# Altium schematic sheet 键盘.SchDoc
size A4
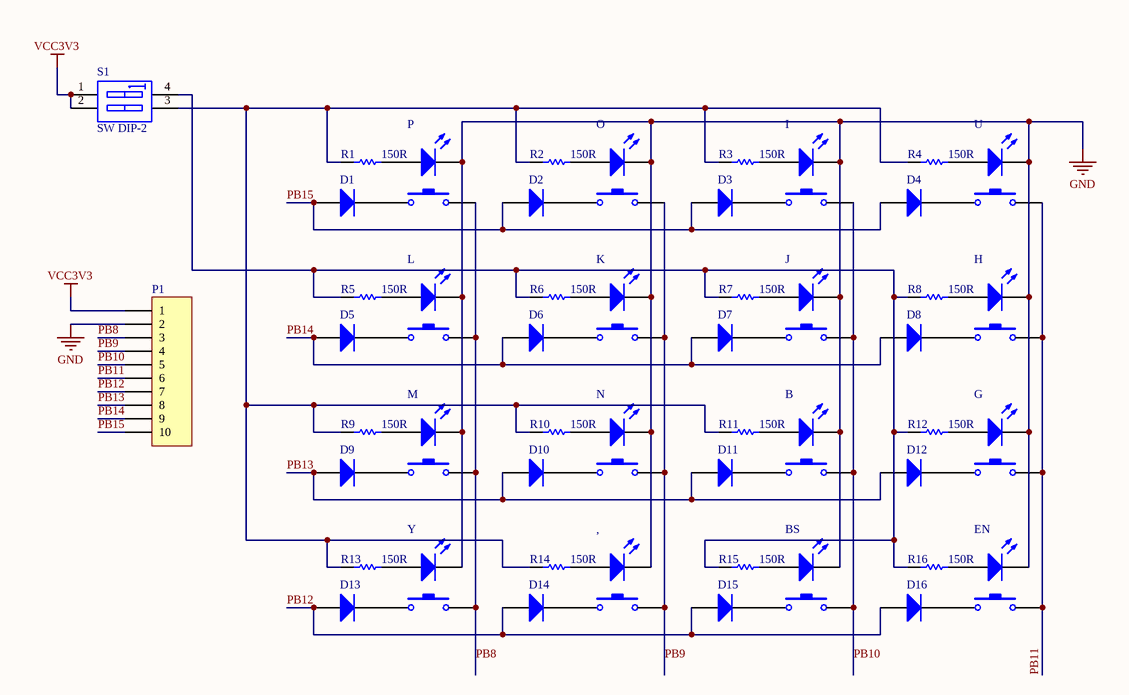
[diagram p0: 键盘.SchDoc]

## Parts
,  MX5  [MX5F]  (value not drawn)
B  MX5  [MX5F]  (value not drawn)
BS  MX5  [MX5F]  (value not drawn)
D1  Diode  [贴片二极管]  (value not drawn)
D2  Diode  [贴片二极管]  (value not drawn)
D3  Diode  [贴片二极管]  (value not drawn)
D4  Diode  [贴片二极管]  (value not drawn)
D5  Diode  [贴片二极管]  (value not drawn)
D6  Diode  [贴片二极管]  (value not drawn)
D7  Diode  [贴片二极管]  (value not drawn)
D8  Diode  [贴片二极管]  (value not drawn)
D9  Diode  [贴片二极管]  (value not drawn)
D10  Diode  [贴片二极管]  (value not drawn)
D11  Diode  [贴片二极管]  (value not drawn)
D12  Diode  [贴片二极管]  (value not drawn)
D13  Diode  [贴片二极管]  (value not drawn)
D14  Diode  [贴片二极管]  (value not drawn)
D15  Diode  [贴片二极管]  (value not drawn)
D16  Diode  [贴片二极管]  (value not drawn)
EN  MX5  [MX5F - 2]  (value not drawn)
G  MX5  [MX5F]  (value not drawn)
H  MX5  [MX5F]  (value not drawn)
I  MX5  [MX5F]  (value not drawn)
J  MX5  [MX5F]  (value not drawn)
K  MX5  [MX5F]  (value not drawn)
L  MX5  [MX5F]  (value not drawn)
M  MX5  [MX5F]  (value not drawn)
N  MX5  [MX5F]  (value not drawn)
O  MX5  [MX5F]  (value not drawn)
P  MX5  [MX5F]  (value not drawn)
P1  PIN10  [PIN10]  (value not drawn)
R1  value 150R  [0805]  (hidden comment: Res)
R2  value 150R  [0805]  (hidden comment: Res)
R3  value 150R  [0805]  (hidden comment: Res)
R4  value 150R  [0805]  (hidden comment: Res)
R5  value 150R  [0805]  (hidden comment: Res)
R6  value 150R  [0805]  (hidden comment: Res)
R7  value 150R  [0805]  (hidden comment: Res)
R8  value 150R  [0805]  (hidden comment: Res)
R9  value 150R  [0805]  (hidden comment: Res)
R10  value 150R  [0805]  (hidden comment: Res)
R11  value 150R  [0805]  (hidden comment: Res)
R12  value 150R  [0805]  (hidden comment: Res)
R13  value 150R  [0805]  (hidden comment: Res)
R14  value 150R  [0805]  (hidden comment: Res)
R15  value 150R  [0805]  (hidden comment: Res)
R16  value 150R  [0805]  (hidden comment: Res)
S1  SW DIP-2  [SW-DIP-2]
U  MX5  [MX5F]  (value not drawn)
Y  MX5  [MX5F]  (value not drawn)

## Nets
GND: ,.K B.K BS.K EN.K G.K H.K I.K J.K K.K L.K M.K N.K O.K P.K P1.2 U.K Y.K
VCC3V3: P1.1 S1.1(A1) S1.2(A2)
PB8: L.2 M.2 P.2 P1.3 Y.2
PB9: ,.2 K.2 N.2 O.2 P1.4
PB10: B.2 BS.2 I.2 J.2 P1.5
PB11: EN.2 G.2 H.2 P1.6 U.2
PB12: D13.1(A) D14.1(A) D15.1(A) D16.1(A) P1.7
PB13: D9.1(A) D10.1(A) D11.1(A) D12.1(A) P1.8
PB14: D5.1(A) D6.1(A) D7.1(A) D8.1(A) P1.9
PB15: D1.1(A) D2.1(A) D3.1(A) D4.1(A) P1.10
Net,_1: ,.1 D14.2(K)
Net,_A: ,.A R14.2
NetB_1: B.1 D11.2(K)
NetB_A: B.A R11.2
NetBS_1: BS.1 D15.2(K)
NetBS_A: BS.A R15.2
NetD1_2: D1.2(K) P.1
NetD2_2: D2.2(K) O.1
NetD3_2: D3.2(K) I.1
NetD4_2: D4.2(K) U.1
NetD5_2: D5.2(K) L.1
NetD6_2: D6.2(K) K.1
NetD7_2: D7.2(K) J.1
NetD8_2: D8.2(K) H.1
NetD9_2: D9.2(K) M.1
NetD10_2: D10.2(K) N.1
NetD12_2: D12.2(K) G.1
NetD13_2: D13.2(K) Y.1
NetD16_2: D16.2(K) EN.1
NetEN_A: EN.A R16.2
NetG_A: G.A R12.2
NetH_A: H.A R8.2
NetI_A: I.A R3.2
NetJ_A: J.A R7.2
NetK_A: K.A R6.2
NetL_A: L.A R5.2
NetM_A: M.A R9.2
NetN_A: N.A R10.2
NetO_A: O.A R2.2
NetP_A: P.A R1.2
NetR1_1: R1.1 R2.1 R3.1 R4.1 R9.1 R10.1 R11.1 R13.1 R14.1 S1.3(B2)
NetR4_2: R4.2 U.A
NetR5_1: R5.1 R6.1 R7.1 R8.1 R12.1 R15.1 R16.1 S1.4(B1)
NetR13_2: R13.2 Y.A

## Library data of the parts
D1-D16 = Diode: Default Diode; Published: 8-Jun-2000; LatestRevisionDate: 17-Jul-2002; LatestRevisionNote: Re-released for DXP Platform.; PackageVersion: Sep-1996; PackageReference: SMC; Publisher: Altium Limited; PackageDescription: DO-214-AB/SMC; 2 C-Bend Leads; Body 7.9 x 5.9 mm, inc. leads (LxW); Code_JEDEC: DO-214-AB
P1 = PIN10: Header, 10-Pin; LatestRevisionDate: 17-Jul-2002; LatestRevisionNote: Re-released for DXP Platform.; Publisher: Altium Limited
R1-R16 = Res: Resistor; Published: 8-Jun-2000; LatestRevisionDate: 17-Jul-2002; LatestRevisionNote: Re-released for DXP Platform.; PackageReference: AXIAL-0.3; Publisher: Altium Limited; PackageDescription: Axial Device, Thru-Hole; 2 Leads; 0.3 in Pin Spacing
S1 = SW DIP-2: DIP Switch, 2 Position, SPST; Published: 24-Mar-1999; LatestRevisionDate: 17-Jul-2002; LatestRevisionNote: Re-released for DXP Platform.; PackageReference: DIP-4; Publisher: Altium Limited